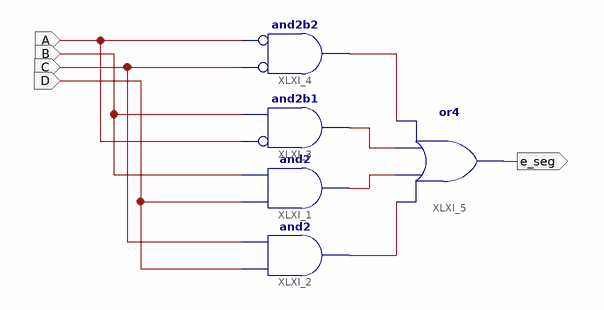
[diagram p0: schematic sheet 1]
// Xilinx ISE schematic bcd4to7e.sch (spartan6) as structural Verilog: 5 symbols, 5 ports
module bcd4to7e (
  input  A,
  input  B,
  input  C,
  input  D,
  output e_seg
);

  wire XLXN_12, XLXN_13, XLXN_14, XLXN_15;

  and XLXI_1 (XLXN_14, D, B);
  and XLXI_2 (XLXN_15, D, C);
  and XLXI_3 (XLXN_13, ~A, B);  // and2b1
  and XLXI_4 (XLXN_12, ~C, ~A);  // and2b2
  or XLXI_5 (e_seg, XLXN_15, XLXN_14, XLXN_13, XLXN_12);
endmodule
